# Altium schematic sheet STAC_Test_Board_v1.SchDoc: STAC Top Level
size B; DrawnBy: Rahul Kumar; Revision: X1; SheetNumber: 1; SheetTotal: 5
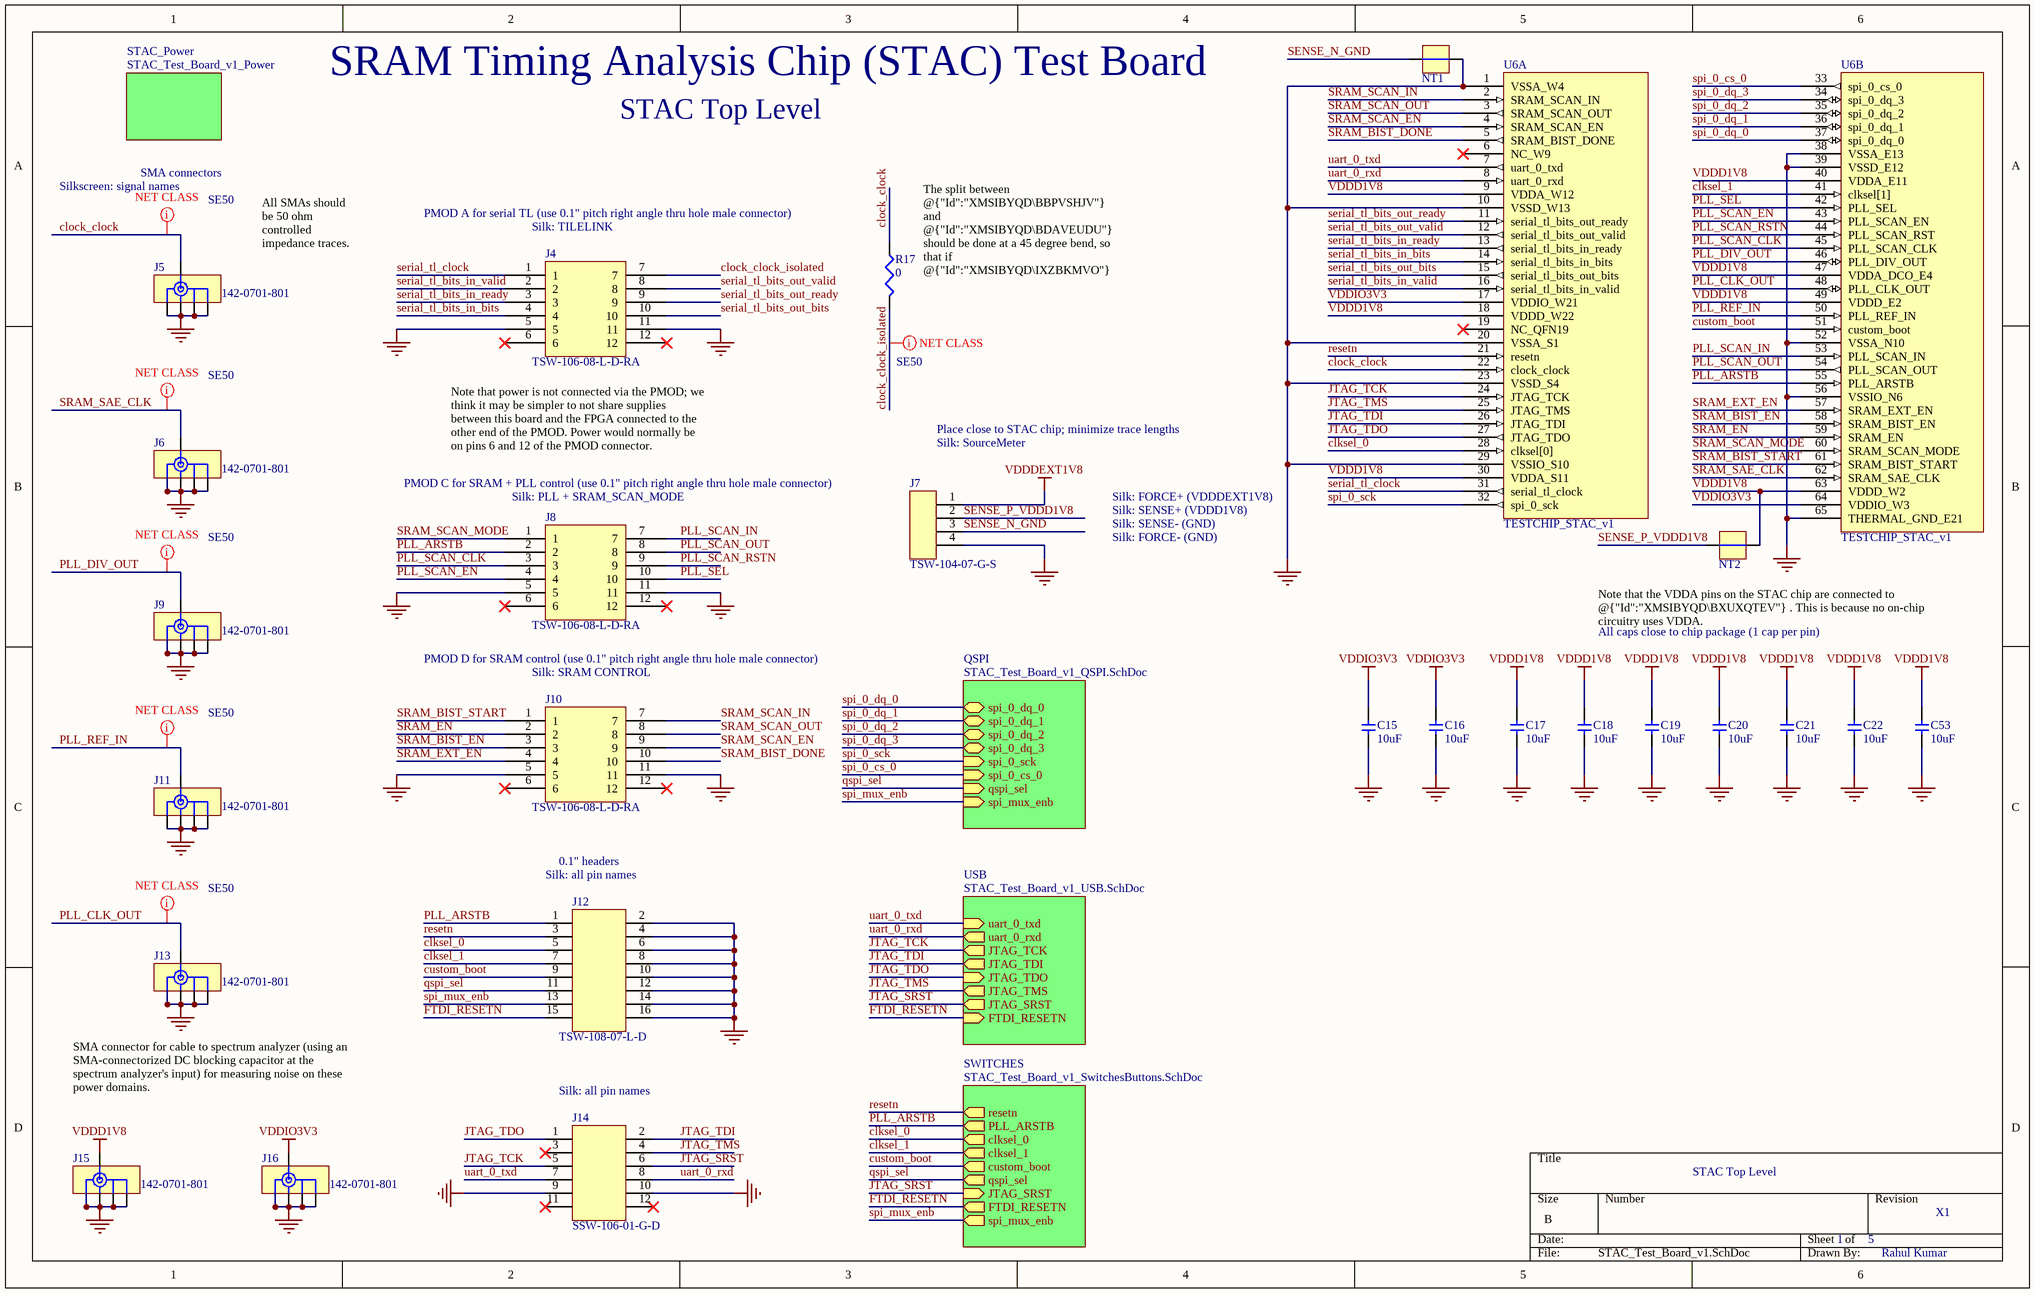
[diagram p0: STAC_Test_Board_v1.SchDoc]

## Parts
C15  10uF  [0603]
C16  10uF  [0603]
C17  10uF  [0603]
C18  10uF  [0603]
C19  10uF  [0603]
C20  10uF  [0603]
C21  10uF  [0603]
C22  10uF  [0603]
C53  10uF  [0603]
J4  TSW-106-08-L-D-RA  [CON-012-100-600X200/2X6-POST-RA_alt]
J5  142-0701-801  [CON-001-9.5X7.9/SMA-EDGE]
J6  142-0701-801  [CON-001-9.5X7.9/SMA-EDGE]
J7  TSW-104-07-G-S  [CON-004-100-400X100/1X4-POST]
J8  TSW-106-08-L-D-RA  [CON-012-100-600X200/2X6-POST-RA_alt]
J9  142-0701-801  [CON-001-9.5X7.9/SMA-EDGE]
J10  TSW-106-08-L-D-RA  [CON-012-100-600X200/2X6-POST-RA_alt]
J11  142-0701-801  [CON-001-9.5X7.9/SMA-EDGE]
J12  TSW-108-07-L-D  [CON-016-100-800X200/2X8-POST]
J13  142-0701-801  [CON-001-9.5X7.9/SMA-EDGE]
J14  SSW-106-01-G-D  [CON-012-100-600X200/2X6-POST]
J15  142-0701-801  [CON-001-9.5X7.9/SMA-EDGE]
J16  142-0701-801  [CON-001-9.5X7.9/SMA-EDGE]
NT1  DISCRETE_NetTie  [NET_TIE_ALT2_10MIL]  (value not drawn)  (net tie, no BOM)
NT2  DISCRETE_NetTie  [NET_TIE_ALT2_10MIL]  (value not drawn)  (net tie, no BOM)
R17  0  [0603]
U6  TESTCHIP_STAC_v1  [QFN-64-.5-9.0X9.0/THERM-7.6]  (parts A,B of 2)

## Sub-sheets
QSPI = STAC_Test_Board_v1_QSPI.SchDoc: spi_0_dq_0 (bidir), spi_0_dq_1 (bidir), spi_0_dq_2 (bidir), spi_0_dq_3 (bidir), spi_0_sck (in), spi_0_cs_0 (in), qspi_sel (in), spi_mux_enb (in)
STAC_Power = STAC_Test_Board_v1_Power: no entries
SWITCHES = STAC_Test_Board_v1_SwitchesButtons.SchDoc: resetn (out), PLL_ARSTB (out), clksel_0 (out), clksel_1 (out), custom_boot (out), qspi_sel (out), JTAG_SRST (in), FTDI_RESETN (out), spi_mux_enb (out)
USB = STAC_Test_Board_v1_USB.SchDoc: uart_0_txd (in), uart_0_rxd (out), JTAG_TCK (out), JTAG_TDI (out), JTAG_TDO (in), JTAG_TMS (out), JTAG_SRST (out), FTDI_RESETN (in)

## Nets
GND: C15.2 C16.2 C17.2 C18.2 C19.2 C20.2 C21.2 C22.2 C53.2 J4.5 J4.11 J5.2 J5.3 J5.4 J5.5 J6.2 J6.3 J6.4 J6.5 J7.4 J8.5 J8.11 J9.2 J9.3 J9.4 J9.5 J10.5 J10.11 J11.2 J11.3 J11.4 J11.5 J12.2 J12.4 J12.6 J12.8 J12.10 J12.12 J12.14 J12.16 J13.2 J13.3 J13.4 J13.5 J14.9 J14.10 J15.2 J15.3 J15.4 J15.5 J16.2 J16.3 J16.4 J16.5 NT1.2 U6.1(VSSA_W4) U6.10(VSSD_W13) U6.20(VSSA_S1) U6.23(VSSD_S4) U6.29(VSSIO_S10) U6.38(VSSA_E13) U6.39(VSSD_E12) U6.52(VSSA_N10) U6.56(VSSIO_N6) U6.65(THERMAL_GND_E21)
VDDD1V8: C17.1 C18.1 C19.1 C20.1 C21.1 C22.1 C53.1 J15.1 NT2.2 U6.9(VDDA_W12) U6.18(VDDD_W22) U6.30(VDDA_S11) U6.40(VDDA_E11) U6.47(VDDA_DCO_E4) U6.49(VDDD_E2) U6.63(VDDD_W2)
VDDDEXT1V8: J7.1
VDDIO3V3: C15.1 C16.1 J16.1 U6.17(VDDIO_W21) U6.64(VDDIO_W3)
clksel_0: J12.5 U6.28(clksel[0]) ; sheet SWITCHES/clksel_0
clksel_1: J12.7 U6.41(clksel[1]) ; sheet SWITCHES/clksel_1
clock_clock: J5.1 R17.1 U6.22(clock_clock)
clock_clock_isolated: J4.7 R17.2
custom_boot: J12.9 U6.51(custom_boot) ; sheet SWITCHES/custom_boot
FTDI_RESETN: J12.15 ; sheet USB/FTDI_RESETN, sheet SWITCHES/FTDI_RESETN
JTAG_SRST: J14.6 ; sheet USB/JTAG_SRST, sheet SWITCHES/JTAG_SRST
JTAG_TCK: J14.5 U6.24(JTAG_TCK) ; sheet USB/JTAG_TCK
JTAG_TDI: J14.2 U6.26(JTAG_TDI) ; sheet USB/JTAG_TDI
JTAG_TDO: J14.1 U6.27(JTAG_TDO) ; sheet USB/JTAG_TDO
JTAG_TMS: J14.4 U6.25(JTAG_TMS) ; sheet USB/JTAG_TMS
PLL_ARSTB: J8.2 J12.1 U6.55(PLL_ARSTB) ; sheet SWITCHES/PLL_ARSTB
PLL_CLK_OUT: J13.1 U6.48(PLL_CLK_OUT)
PLL_DIV_OUT: J9.1 U6.46(PLL_DIV_OUT)
PLL_REF_IN: J11.1 U6.50(PLL_REF_IN)
PLL_SCAN_CLK: J8.3 U6.45(PLL_SCAN_CLK)
PLL_SCAN_EN: J8.4 U6.43(PLL_SCAN_EN)
PLL_SCAN_IN: J8.7 U6.53(PLL_SCAN_IN)
PLL_SCAN_OUT: J8.8 U6.54(PLL_SCAN_OUT)
PLL_SCAN_RSTN: J8.9 U6.44(PLL_SCAN_RST)
PLL_SEL: J8.10 U6.42(PLL_SEL)
qspi_sel: J12.11 ; sheet QSPI/qspi_sel, sheet SWITCHES/qspi_sel
resetn: J12.3 U6.21(resetn) ; sheet SWITCHES/resetn
SENSE_N_GND: J7.3 NT1.1
SENSE_P_VDDD1V8: J7.2 NT2.1
serial_tl_bits_in_bits: J4.4 U6.14(serial_tl_bits_in_bits)
serial_tl_bits_in_ready: J4.3 U6.13(serial_tl_bits_in_ready)
serial_tl_bits_in_valid: J4.2 U6.16(serial_tl_bits_in_valid)
serial_tl_bits_out_bits: J4.10 U6.15(serial_tl_bits_out_bits)
serial_tl_bits_out_ready: J4.9 U6.11(serial_tl_bits_out_ready)
serial_tl_bits_out_valid: J4.8 U6.12(serial_tl_bits_out_valid)
serial_tl_clock: J4.1 U6.31(serial_tl_clock)
spi_0_cs_0: U6.33(spi_0_cs_0) ; sheet QSPI/spi_0_cs_0
spi_0_dq_0: U6.37(spi_0_dq_0) ; sheet QSPI/spi_0_dq_0
spi_0_dq_1: U6.36(spi_0_dq_1) ; sheet QSPI/spi_0_dq_1
spi_0_dq_2: U6.35(spi_0_dq_2) ; sheet QSPI/spi_0_dq_2
spi_0_dq_3: U6.34(spi_0_dq_3) ; sheet QSPI/spi_0_dq_3
spi_0_sck: U6.32(spi_0_sck) ; sheet QSPI/spi_0_sck
spi_mux_enb: J12.13 ; sheet QSPI/spi_mux_enb, sheet SWITCHES/spi_mux_enb
SRAM_BIST_DONE: J10.10 U6.5(SRAM_BIST_DONE)
SRAM_BIST_EN: J10.3 U6.58(SRAM_BIST_EN)
SRAM_BIST_START: J10.1 U6.61(SRAM_BIST_START)
SRAM_EN: J10.2 U6.59(SRAM_EN)
SRAM_EXT_EN: J10.4 U6.57(SRAM_EXT_EN)
SRAM_SAE_CLK: J6.1 U6.62(SRAM_SAE_CLK)
SRAM_SCAN_EN: J10.9 U6.4(SRAM_SCAN_EN)
SRAM_SCAN_IN: J10.7 U6.2(SRAM_SCAN_IN)
SRAM_SCAN_MODE: J8.1 U6.60(SRAM_SCAN_MODE)
SRAM_SCAN_OUT: J10.8 U6.3(SRAM_SCAN_OUT)
uart_0_rxd: J14.8 U6.8(uart_0_rxd) ; sheet USB/uart_0_rxd
uart_0_txd: J14.7 U6.7(uart_0_txd) ; sheet USB/uart_0_txd

Not connected (* = marked no-connect by the designer): J4 6* 12*; J8 6* 12*; J10 6* 12*; J14 3* 11* 12*; U6 6(NC_W9)* 19(NC_QFN19)*

## Layout directives
net class SE50: clock_clock, clock_clock_isolated, PLL_CLK_OUT, PLL_DIV_OUT, PLL_REF_IN, SRAM_SAE_CLK

## Notes on the sheet
- SRAM Timing Analysis Chip (STAC) Test Board
- Silkscreen: signal names
- SMA connectors
- PMOD A for serial TL (use 0.1" pitch right angle thru hole male connector)
- (near J4) Silk: TILELINK
- All SMAs should be 50 ohm controlled impedance traces.
- (near R17) The split between @{"Id":"XMSIBYQD\BBPVSHJV"} and @{"Id":"XMSIBYQD\BDAVEUDU"} should be done at a 45 degree bend, so that if @{"Id":"XMSIBYQD\IXZBKMVO"} is not placed, @{"Id":"XMSIBYQD\BBPVSHJV"} does not see any sharp bends.
- Place close to STAC chip; minimize trace lengths
- PMOD C for SRAM + PLL control (use 0.1" pitch right angle thru hole male connector)
- (near J4) Note that power is not connected via the PMOD; we think it may be simpler to not share supplies between this board and the FPGA connected to the other end of the PMOD. Power would normally be on pins 6 and 12 of the PMOD connector.
- (near J8) Silk: PLL + SRAM_SCAN_MODE
- Silk: SourceMeter
- Silk: FORCE+ (VDDDEXT1V8)
- Silk: SENSE+ (VDDD1V8)
- Silk: SENSE- (GND)
- Silk: FORCE- (GND)
- All caps close to chip package (1 cap per pin)
- (near NT2) Note that the VDDA pins on the STAC chip are connected to @{"Id":"XMSIBYQD\BXUXQTEV"} . This is because no on-chip circuitry uses VDDA.
- PMOD D for SRAM control (use 0.1" pitch right angle thru hole male connector)
- Silk: SRAM CONTROL
- (near J12) Silk: all pin names
- 0.1" headers
- SMA connector for cable to spectrum analyzer (using an SMA-connectorized DC blocking capacitor at the spectrum analyzer's input) for measuring noise on these power domains.
- (near J14) Silk: all pin names

## Library data of the parts
C15-C22 C53 = DISCRETE_C: Capacitor generic
J4 J8 J10 J14 = CON_012pin_2x6: Con 12 pins 2x6
J5 J6 J9 J11 J13 J15 J16 = CON_RF_SMA: Con RF SMA
J7 = CON_004pin_1x4: Con 4 pins 1x4
J12 = CON_016pin_2x8: Con 16 pins 2x8
NT1 NT2 = DISCRETE_NetTie: Net tie
R17 = DISCRETE_R: Resistor generic
U6 = TESTCHIP_STAC_v1: TESTCHIP STAC v1